# EAGLE schematic Master (EAGLE 6.5.0)
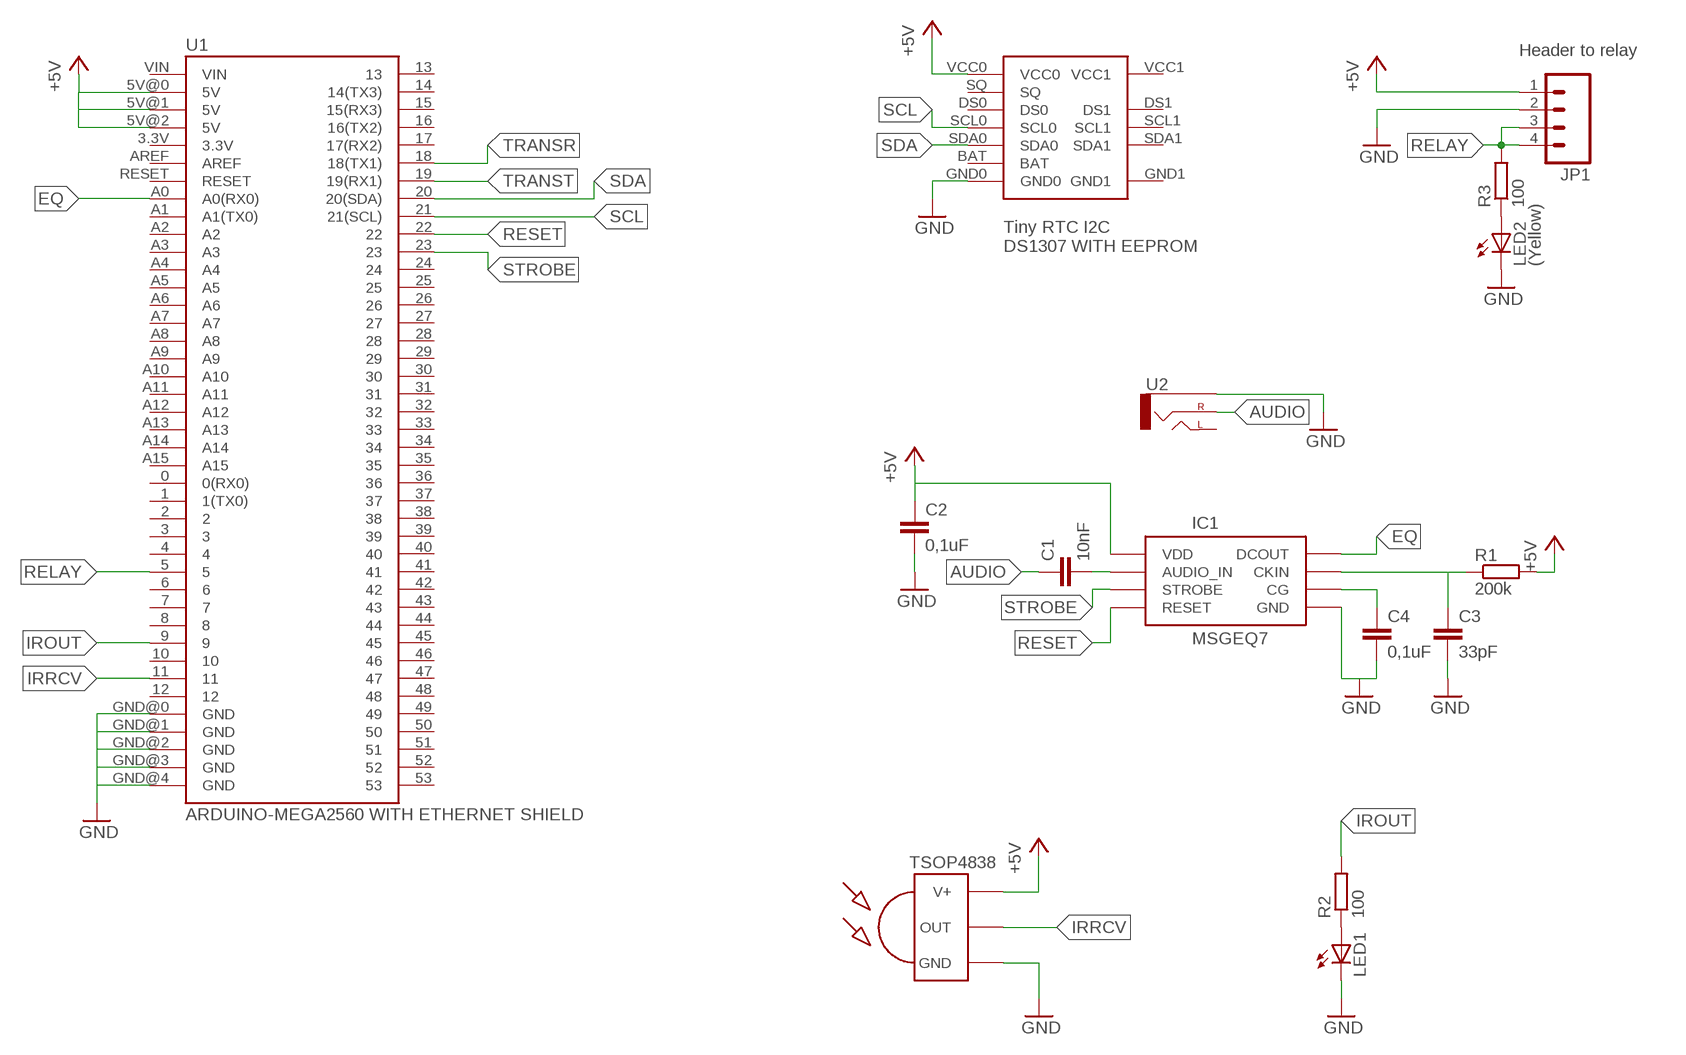
[diagram p0: schematic, sheet 1]

## Parts
C1  10nF  CAPEZ  [CAP-PTH-SMALLEZ]
C2  0,1uF  CAPEZ  [CAP-PTH-SMALLEZ]
C3  33pF  CAPEZ  [CAP-PTH-SMALLEZ]
C4  0,1uF  CAPEZ  [CAP-PTH-SMALLEZ]
IC1  MSGEQ7DIP  [DIL08]
JP1  M041.27MM  [1X04-1.27MM]
LED1  LED5MM  [LED5MM]
LED2  (Yellow)  LED3MM  [LED3MM]
R1  200k  R-EU_0204/5  [0204/5]
R2  100  R-EU_0204/5  [0204/5]
R3  100  R-EU_0204/5  [0204/5]
U1  ARDUINO-MEGA2560 WITH ETHERNET SHIELD  ARDUINO-MEGAFULL  [ARDUINO_MEGA]
U2  AUDIO-JACKPTH  [AUDIO-JACK]
U$1  TINYRTC  [TINYRTC]
U$2  TSOP4838  [TSOP18XX]

## Nets
+5V: C2.1 IC1.1(VDD) JP1.1 R1.2 U1.5V@0(5V) U1.5V@1(5V) U1.5V@2(5V) U$1.VCC0 U$2.VCC(V+)
AUDIO: C1.1 U2.RING(RIGHT)
EQ: IC1.3(DCOUT) U1.A0(A0(RX0))
GND: C2.2 C3.2 C4.2 IC1.2(GND) JP1.2 LED1.K(C) LED2.K(C) U1.GND@0(GND) U1.GND@1(GND) U1.GND@2(GND) U1.GND@3(GND) U1.GND@4(GND) U2.SLEEVE U$1.GND0 U$2.GND
IROUT: R2.2 U1.9
IRRCV: U1.11 U$2.OUT
N$1: C1.2 IC1.5(AUDIO_IN)
N$2: C4.1 IC1.6(CG)
N$3: C3.1 IC1.8(CKIN) R1.1
N$4: LED1.A R2.1
N$5: LED2.A R3.1
RELAY: JP1.3 JP1.4 R3.2 U1.5
RESET: IC1.7(RESET) U1.22
SCL: U1.21(21(SCL)) U$1.SCL0
SDA: U1.20(20(SDA)) U$1.SDA0
STROBE: IC1.4(STROBE) U1.23
TRANSR: U1.18(18(TX1))
TRANST: U1.19(19(RX1))
Unconnected: U1.0(0(RX0)) U1.1(1(TX0)) U1.2 U1.3 U1.3.3V U1.4 U1.6 U1.7 U1.8 U1.10 U1.12 U1.13 U1.14(14(TX3)) U1.15(15(RX3)) U1.16(16(TX2)) U1.17(17(RX2)) U1.24 U1.25 U1.26 U1.27 U1.28 U1.29 U1.30 U1.31 U1.32 U1.33 U1.34 U1.35 U1.36 U1.37 U1.38 U1.39 U1.40 U1.41 U1.42 U1.43 U1.44 U1.45 U1.46 U1.47 U1.48 U1.49 U1.50 U1.51 U1.52 U1.53 U1.A1(A1(TX0)) U1.A2 U1.A3 U1.A4 U1.A5 U1.A6 U1.A7 U1.A8 U1.A9 U1.A10 U1.A11 U1.A12 U1.A13 U1.A14 U1.A15 U1.AREF U1.RESET U1.VIN U2.TIP(LEFT) U$1.BAT U$1.DS0 U$1.DS1 U$1.GND1 U$1.SCL1 U$1.SDA1 U$1.SQ U$1.VCC1

## Notes on the sheet
- Header to relay

## Library data of the parts
C1-C4 = SparkFun-Capacitors:CAP: Capacitor Standard 0603 ceramic capacitor, and 0.1" leaded capacitor.
IC1 = msgeq7:MSGEQ7: 7-band graphic equalizer
JP1 = SparkFun-Connectors:M04: Header 4 Standard 4-pin 0.1" header. Use with straight break away headers (SKU : PRT-00116), right angle break away headers (PRT-00553), swiss pins (PRT-00743), machine pins (PRT-00117), and female headers (PRT-00115). Molex polarized connector foot print use with SKU : PRT-08231 with associated crimp pins and housings. 1MM SMD Version SKU: PRT-10208
LED1 LED2 = adafruit:LED: LED OSRAM: - CHIPLED LG R971, LG N971, LY N971, LG Q971, LY Q971, LO R971, LY R971 LH N974, LH R974 LS Q976, LO Q976, LY Q976 LO Q996 - Hyper CHIPLED LW Q18S LB Q993, LB Q99A, LB R99A - SideLED LS A670, LO A670, LY A670, LG A670, LP A670 LB A673, LV A673, LT A673, LW A673 LH A674 LY A675 LS A676, LA A676, LO A676, LY A676, LW A676 LS A679, LY A679, LG A679 - Hyper Micro SIDELED® LS Y876, LA Y876, LO Y876, LY Y876 LT Y87S - SmartLED LW L88C, LW L88S LB L89C, LB L89S, LG L890 LS L89K, LO L89K, LY L89K LS L896, LA L896, LO L896, LY L896 - TOPLED LS T670, LO T670, LY T670, LG T670, LP T670 LSG T670, LSP T670, LSY T670, LOP T670, LYG T670 LG T671, LOG T671, LSG T671 LB T673, LV T673, LT T673, LW T673 LH T674 LS T676, LA T676, LO T676, LY T676, LB T676, LH T676, LSB T676, LW T676 LB T67C, LV T67C, LT T67C, LS T67K, LO T67K, LY T67K, LW E67C LS E67B, LA E67B, LO E67B, LY E67B, LB E67C, LV E67C, LT E67C LW T67C LS T679, LY T679, LG T679 LS T770, LO T770, LY T770, LG T770, LP T770 LB T773, LV T773, LT T773, LW T773 LH T774 LS E675, LA E675, LY E675, LS T675 LS T776, LA T776, LO T776, LY T776, LB T776 LHGB T686 LT T68C, LB T68C - Hyper Mini TOPLED® LB M676 - Mini TOPLED Santana® LG M470 LS M47K, LO M47K, LY M47K Source: http://www.osram.convergy.de/
R1-R3 = rcl:R-EU_: RESISTOR, European symbol
U1 = SparkFun-Boards:ARDUINO-MEGA: Arduino Mega board footprint
U2 = SparkFun-Connectors:AUDIO-JACK: 3.5mm Audio Jack Simple 3.5mm common PCB mount audio jack. SKU: PRT-08032
U$1 = TinyRTC:TINYRTC
U$2 = tsop-1:TSOP4838: IR Receiver and Demodulator